# Altium schematic sheet p3_intf_conn.SchDoc
size OrCAD B; SheetNumber: 3; SheetTotal: 4
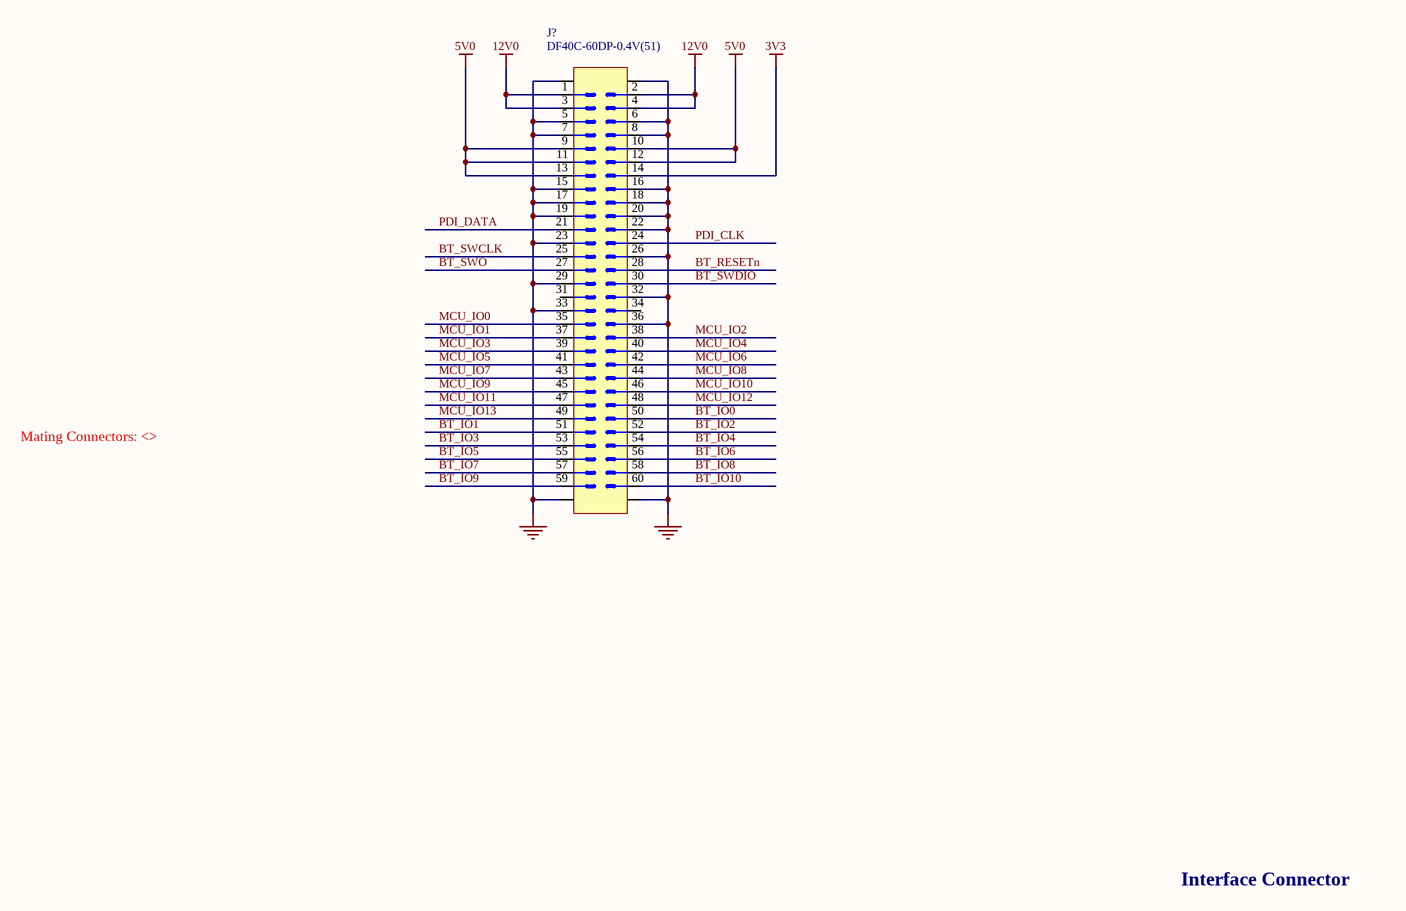
[diagram p0: p3_intf_conn.SchDoc]

## Parts
J?  DF40C-60DP-0.4V(51)  [HRS_DF40C_60P_PLG]

## Nets
3V3: J?.14
5V0: J?.9 J?.10 J?.11 J?.12 J?.13
12V0: J?.1 J?.2 J?.3 J?.4
GND: J?.5 J?.6 J?.7 J?.8 J?.15 J?.16 J?.17 J?.18 J?.19 J?.20 J?.22 J?.23 J?.26 J?.29 J?.32 J?.33 J?.36 J?.61 J?.62 J?.63 J?.64
BT_IO0: J?.50
BT_IO1: J?.51
BT_IO2: J?.52
BT_IO3: J?.53
BT_IO4: J?.54
BT_IO5: J?.55
BT_IO6: J?.56
BT_IO7: J?.57
BT_IO8: J?.58
BT_IO9: J?.59
BT_IO10: J?.60
BT_RESETn: J?.28
BT_SWCLK: J?.25
BT_SWDIO: J?.30
BT_SWO: J?.27
MCU_IO0: J?.35
MCU_IO1: J?.37
MCU_IO2: J?.38
MCU_IO3: J?.39
MCU_IO4: J?.40
MCU_IO5: J?.41
MCU_IO6: J?.42
MCU_IO7: J?.43
MCU_IO8: J?.44
MCU_IO9: J?.45
MCU_IO10: J?.46
MCU_IO11: J?.47
MCU_IO12: J?.48
MCU_IO13: J?.49
PDI_CLK: J?.24
PDI_DATA: J?.21

Not connected (* = marked no-connect by the designer): J? 31 34

## Notes on the sheet
- Mating Connectors: <>
- Interface Connector

## Library data of the parts
J? = 60P 0.4mm Hirose Conn Plug: CONN HDR 60POS 0.4MM SMD GOLD; Manufacturer: Hirose; Connector Type: Plug; Number of Contacts: 60; Voltage Rating: 30V; Current Rating: 300mA; Gender: Male; Stack Height: 3.5mm; Supplier 1: Digi-Key; Manufacturer Part Number: DF40C-60DP-0.4V(51); Stock 1: 18849; Pricing 1: 1=1.24, 10=1.094, 25=1.0296, 50=0.9868, 100=0.9438, 250=0.858, 500=0.7722, 1000=0.6864, 2500=0.6221 (USD); Mount: Surface Mount; Case/Package: SMD/SMT; Contact Material: Bronze; Contact Plating: Gold; Housing Material: Polymer; Termination: SMD/SMT; Package Quantity: 5000; Number of Rows: 2; Packaging: Tape and Reel; Number of Positions: 60; Pitch: 0.4mm; REACH SVHC: No SVHC; Lead Free: Lead Free; ComponentLink1URL: https://datasheet.ciiva.com/46408/1824826-46408908.pdf; ComponentLink1Description: https://datasheet.ciiva.com/46408/1824826-46408908.pdf; Supplier Part Number 1: H11628CT-ND